# Altium schematic sheet SH4 - SPI ENCODERS.SchDoc: Arm - SPI Encoders
size Letter; DrawnBy: N.Chapman, K.Hong; Organization: UW Robotics; Address1: 200 University Avenue; Address2: Waterloo; Address3: Ontario; Address4: Canada N2L 3G6; SheetNumber: 9; SheetTotal: 9
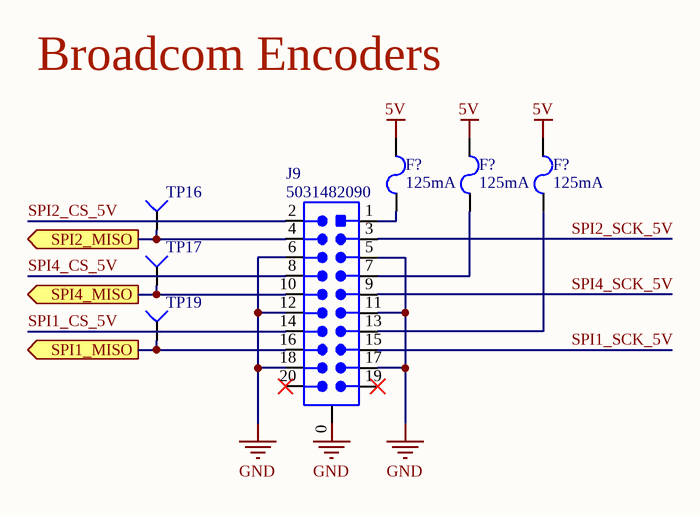
[diagram p0: SH4 - SPI ENCODERS.SchDoc]

## Parts
(Parts that share a designator on the sheet are numbered #1, #2 ... from top to bottom, then left to right.)
F?#1  Current Rating: 125mA  [FUSE_1206]  (hidden comment: FUSE_125mA_1206)
F?#2  Current Rating: 125mA  [FUSE_1206]  (hidden comment: FUSE_125mA_1206)
F?#3  Current Rating: 125mA  [FUSE_1206]  (hidden comment: FUSE_125mA_1206)
J9  Manufacturer Part Number 1: 5031482090  [MOLEX-5031482090]  (hidden comment: CON_10x2M_SM_RA)
TP16  TESTPOINT_1MM_CIRCLE  [TESTPOINT_CIRCLE_1MM]  (value not drawn)  (no BOM)
TP17  TESTPOINT_1MM_CIRCLE  [TESTPOINT_CIRCLE_1MM]  (value not drawn)  (no BOM)
TP19  TESTPOINT_1MM_CIRCLE  [TESTPOINT_CIRCLE_1MM]  (value not drawn)  (no BOM)

## Ports
SPI1_MISO (out), SPI2_MISO (out), SPI4_MISO (out)

## Nets
5V: F?#1.2 F?#2.2 F?#3.2
GND: J9.0 J9.5 J9.6 J9.11 J9.12 J9.17 J9.18
SPI1_CS_5V: J9.14
SPI1_MISO: J9.16 TP19.1(=value) ; port SPI1_MISO
SPI1_SCK_5V: J9.15
SPI2_CS_5V: J9.2
SPI2_MISO: J9.4 TP16.1(=value) ; port SPI2_MISO
SPI2_SCK_5V: J9.3
SPI4_CS_5V: J9.8
SPI4_MISO: J9.10 TP17.1(=value) ; port SPI4_MISO
SPI4_SCK_5V: J9.9
NetF?#1_1: F?#1.1 J9.1
NetF?#2_1: F?#2.1 J9.7
NetF?#3_1: F?#3.1 J9.13

Not connected (* = marked no-connect by the designer): J9 19* 20*

## Notes on the sheet
- Broadcom Encoders
- Title
- Size:
- Date:
- Letter
- Drawn By:
- Sheet
- of
- File:

## Library data of the parts
F?#1-F?#3 = FUSE_125mA_1206: Electric Fuse, Very Fast Blow, 0.125A, 125VAC, 125VDC, 50A (IR), Surface Mount, 1206; Manufacturer 1: Littelfuse; Manufacturer Part Number 1: 0466.125NR; Fuse Class: Supplemental; Fuse Size: 1206; Joule-integral-Nom: 0.0004J; Pre-arcing Rating: 0.0004A2/s; Voltage Rating: 125V; Trip Time or Delay: 14400s; Body Breadth: 1.52inch; Body Height: 0.58mm; Body Length or Diameter: 3.18mm; Reference Standard: UL; Supplier 1: Digi-Key; RoHS: Yes; Category: Fuses; Stock 1: 32549; Pricing 1: 1=0.81000, 5=0.78200, 10=0.75800, 50=0.63760, 100=0.52930, 250=0.48120, 500=0.40902, 1000=0.36090 (USD); Mount: Surface Mount; Terminal Finish: Nickel; Min Operating Temperature: -55°C; Max Operating Temperature: 90°C; Blow Characteristic: VERY FAST; Circuit Protection Type: Electric Fuse; Packaging: Tape and Reel; Rated Breaking Capacity: 50A; Voltage Rating (AC): 125V; Voltage Rating (DC): 125V; Termination: End Cap; JESD-609 Code: e3; ComponentLink1URL: https://datasheet.ciiva.com:443/pdfs/VipMasterIC/IC/LFSI/LFSIS12462/LFSIS12462-1.pdf?src-supplier=IHS+Markit; ComponentLink1Description: https://datasheet.ciiva.com:443/pdfs/VipMasterIC/IC/LFSI/LFSIS12462/LFSIS12462-1.pdf?src-supplier=IHS+Markit; ComponentLink2URL: https://datasheet.ciiva.com/1549/48294-1549700.pdf?src-supplier=Element14; ComponentLink2Description: https://datasheet.ciiva.com/1549/48294-1549700.pdf?src-supplier=Element14; ComponentLink3URL: https://datasheet.ciiva.com/46406/1796765-46406158.pdf?src-supplier=Element14; ComponentLink3Description: https://datasheet.ciiva.com/46406/1796765-46406158.pdf?src-supplier=Element14; ComponentLink4URL: https://datasheet.ciiva.com/299/466seriesdrawing-299204.pdf?src-supplier=Digi-Key; ComponentLink4Description: https://datasheet.ciiva.com/299/466seriesdrawing-299204.pdf?src-supplier=Digi-Key; ComponentLink5URL: https://datasheet.ciiva.com/299/466seriesdrawing-299205.pdf?src-supplier=Digi-Key; ComponentLink5Description: https://datasheet.ciiva.com/299/466seriesdrawing-299205.pdf?src-supplier=Digi-Key; ComponentLink6URL: https://datasheet.ciiva.com/299/466seriesdrawing-299206.pdf?src-supplier=Digi-Key; ComponentLink6Description: https://datasheet.ciiva.com/299/466seriesdrawing-299206.pdf?src-supplier=Digi-Key; ComponentLink7URL: https://datasheet.ciiva.com/22713/48294-22713046.pdf?src-supplier=Element14; ComponentLink7Description: https://datasheet.ciiva.com/22713/48294-22713046.pdf?src-supplier=Element14; ComponentLink8URL: https://datasheet.ciiva.com/15186/getdatasheetpartid-57352-15186925.pdf?src-supplier=Verical; ComponentLink8Description: https://datasheet.ciiva.com/15186/getdatasheetpartid-57352-15186925.pdf?src-supplier=Verical; Supplier Part Number 1: F1450CT-ND
J9 = CON_10x2M_SM_RA: CONN HEADER SMD RIGHT ANGLE 1.5MM PITCH; Manufacturer 1: Molex; Voltage Rating: 100V; Current Rating: 1A; Connector Type: Receptacle,Forked,Center Strip Contact; Number of Positions: 20; Gender: Receptacle; Glow Wire Compliant: Non-compliant; Supplier 1: Digi-Key; Stock 1: 1742; Pricing 1: 1=2.37000, 10=2.14700, 100=1.83990 (USD); RoHS: Yes; Mount: Surface Mount,Through Hole; Housing Material: Resin; Color: Beige; Housing Color: Beige; Contact Material: Copper Alloy,Copper,Tin; Contact Plating: Tin; Min Operating Temperature: -25°C; Max Operating Temperature: 85°C; Number of Rows: 2; Packaging: Tape and Reel; Package Quantity: 550; Fastening Type: Latch; Orientation: Right Angle; Termination: Solder; Number of Contacts: 20; Contact Gender: Female; Number of Circuits: 20; Length: 19.3mm; Pitch: 1.5mm; Row Spacing: 1.5mm; Depth: 9.55mm; Radiation Hardening: No; REACH SVHC: No SVHC; ComponentLink1URL: https://datasheet.ciiva.com/6787/5031482090-sd-6787557.pdf?src-supplier=Digi-Key; ComponentLink1Description: https://datasheet.ciiva.com/6787/5031482090-sd-6787557.pdf?src-supplier=Digi-Key; ComponentLink2URL: https://datasheet.ciiva.com/10076/5031482090-pcb-receptacles-10076785.pdf?src-supplier=Avnet; ComponentLink2Description: https://datasheet.ciiva.com/10076/5031482090-pcb-receptacles-10076785.pdf?src-supplier=Avnet; ComponentLink3URL: https://datasheet.ciiva.com/5153/5031482090-pcb-receptacles-179510-5153198.pdf?src-supplier=Mouser; ComponentLink3Description: https://datasheet.ciiva.com/5153/5031482090-pcb-receptacles-179510-5153198.pdf?src-supplier=Mouser; ComponentLink4URL: https://datasheet.ciiva.com/30082/72715031482090-pcb-receptacles-30082526.pdf?src-supplier=Onlinecomponents.com; ComponentLink4Description: https://datasheet.ciiva.com/30082/72715031482090-pcb-receptacles-30082526.pdf?src-supplier=Onlinecomponents.com; ComponentLink5URL: https://datasheet.ciiva.com/6787/5031482090-sd-6787542.pdf?src-supplier=Digi-Key; ComponentLink5Description: https://datasheet.ciiva.com/6787/5031482090-sd-6787542.pdf?src-supplier=Digi-Key; ComponentLink6URL: https://datasheet.ciiva.com/6787/5031482090-sd-6787548.pdf?src-supplier=Digi-Key; ComponentLink6Description: https://datasheet.ciiva.com/6787/5031482090-sd-6787548.pdf?src-supplier=Digi-Key; Supplier Part Number 1: WM9451CT-ND
TP16 TP17 TP19 = TESTPOINT_1MM_CIRCLE: TESTPOINT 1MM CIRCLE; Part Number (MPN): *